# EAGLE design Custom Board 1_Final (EAGLE 6.5.0)
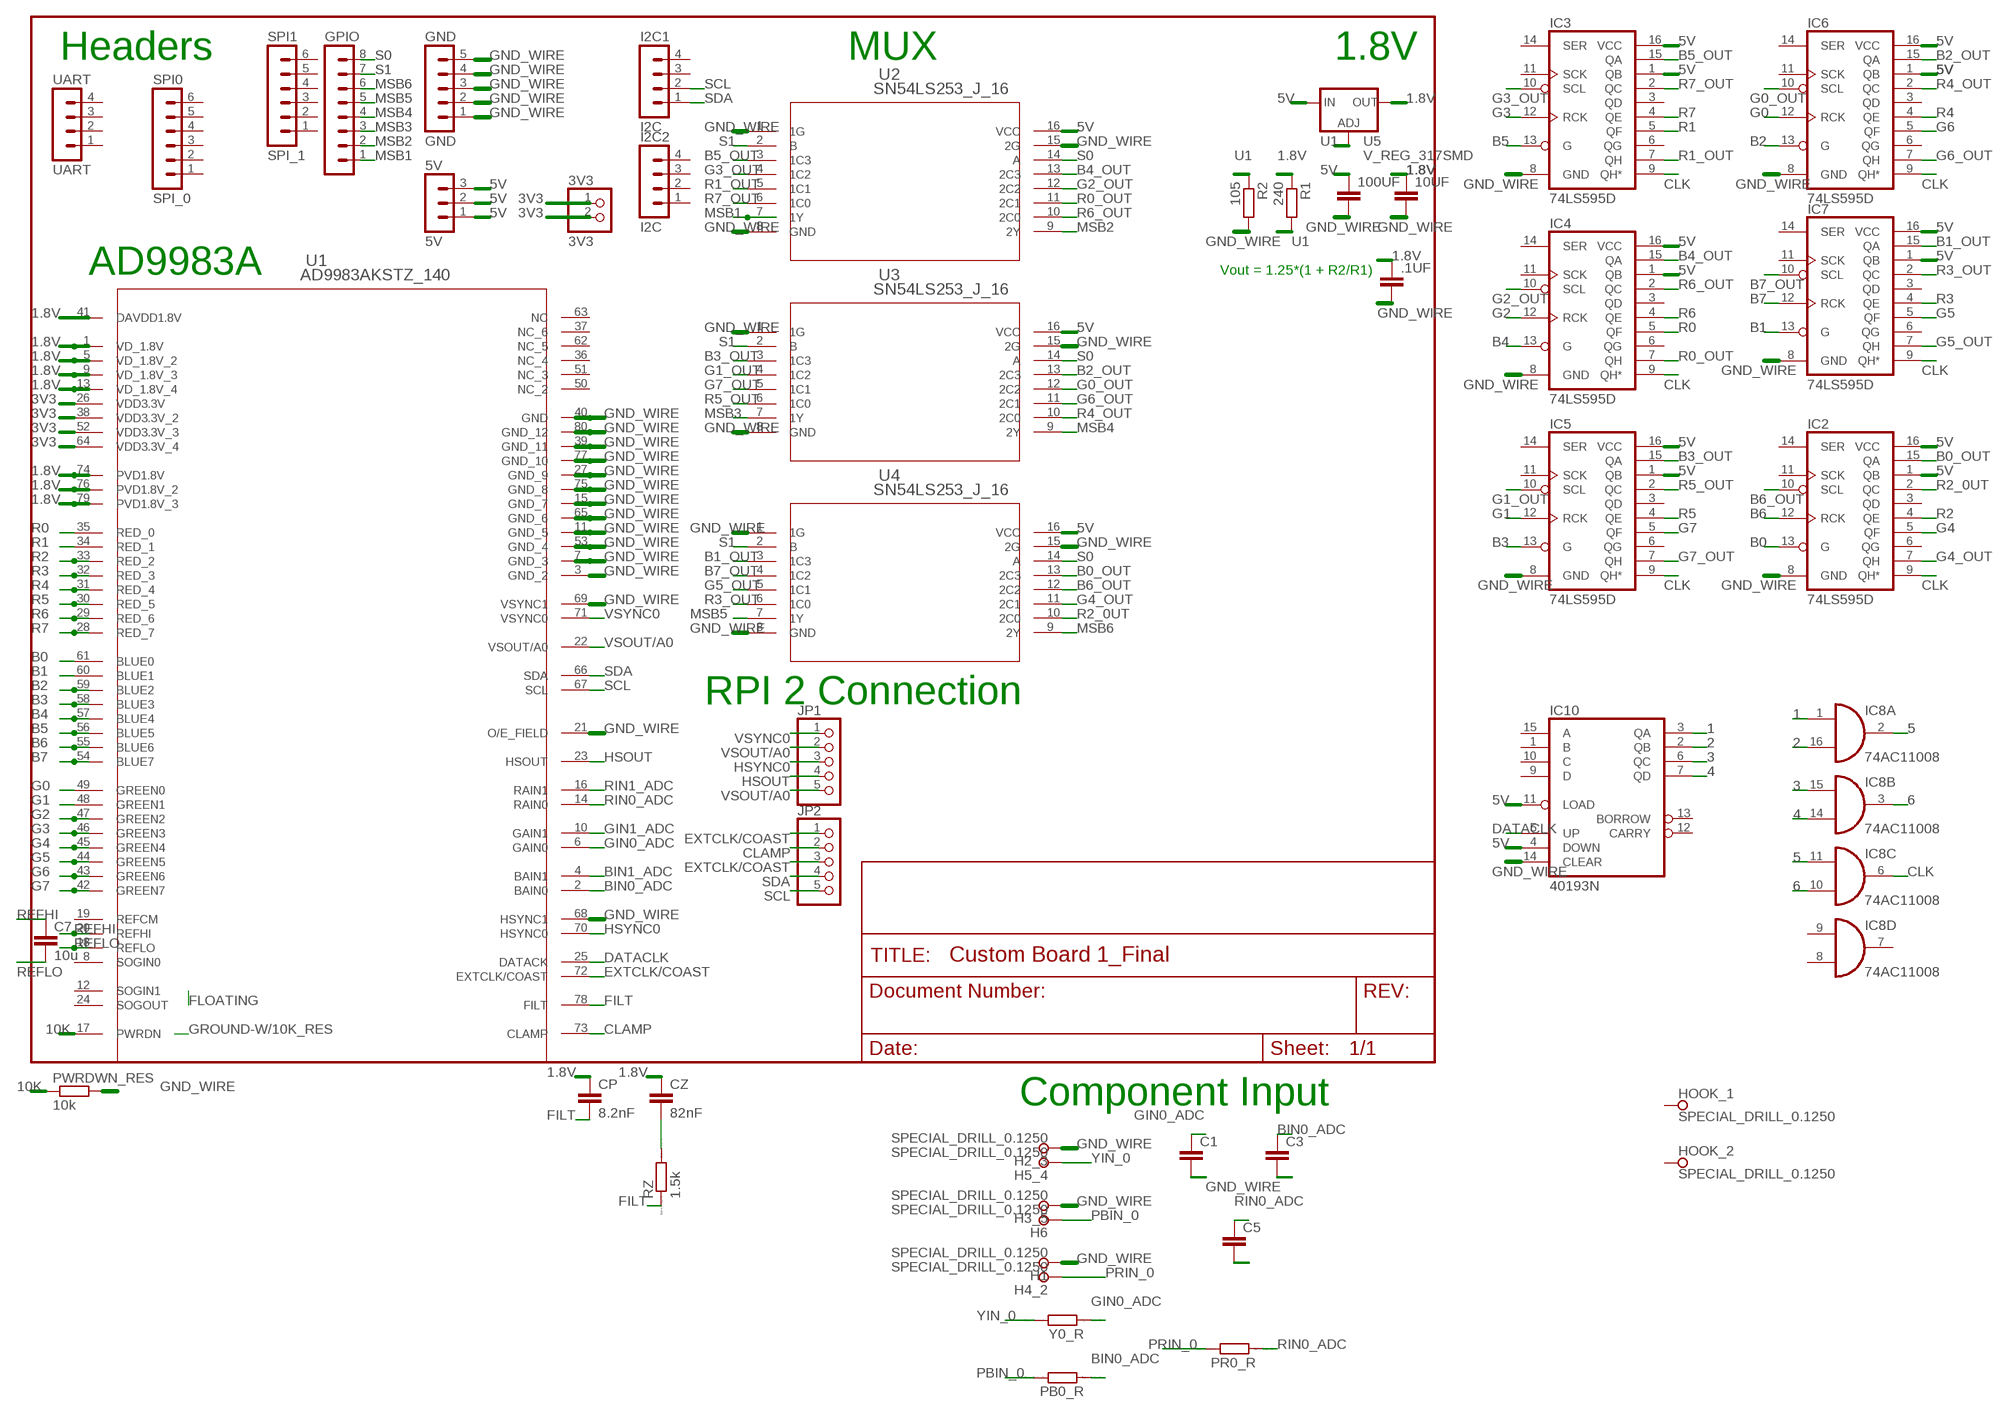
[diagram p0: schematic, sheet 1]

## Parts
3V3  3V3  PINHD-1X2  [1X02]
5V  5V  MA03-1  [MA03-1]
10UF  C2.5/5  [C2.5-5]
100UF  C2.5/5  [C2.5-5]
.1UF  C2.5/5  [C2.5-5]
C1  C2.5/5  [C2.5-5]
C3  C2.5/5  [C2.5-5]
C5  C2.5/5  [C2.5-5]
C7  10u  C2.5/5  [C2.5-5]
CP  8.2nF  C2.5/5  [C2.5-5]
CZ  82nF  C2.5/5  [C2.5-5]
GND  GND  MA05-1  [MA05-1]
GPIO  MA08-1  [MA08-1]
H1  SPECIAL_DRILL_0.1250  [PAD_0.1250]
H2_3  SPECIAL_DRILL_0.1250  [PAD_0.1250]
H3_5  SPECIAL_DRILL_0.1250  [PAD_0.1250]
H4_2  SPECIAL_DRILL_0.1250  [PAD_0.1250]
H5_4  SPECIAL_DRILL_0.1250  [PAD_0.1250]
H6  SPECIAL_DRILL_0.1250  [PAD_0.1250]
HOOK_1  SPECIAL_DRILL_0.1250  [PAD_0.1250]
HOOK_2  SPECIAL_DRILL_0.1250  [PAD_0.1250]
I2C1  I2C  MA04-1  [MA04-1]
I2C2  I2C  MA04-1  [MA04-1]
IC2  74LS595D  [SO16]
IC3  74LS595D  [SO16]
IC4  74LS595D  [SO16]
IC5  74LS595D  [SO16]
IC6  74LS595D  [SO16]
IC7  74LS595D  [SO16]
IC8  74AC11008  [DIL16]
IC10  40193N  [DIL16]
JP1  PINHD-1X5  [1X05]
JP2  PINHD-1X5  [1X05]
PB0_R  R0204/7  [0204/7]
PR0_R  R0204/7  [0204/7]
PWRDWN_RES  10k  R-EU_0204/7  [0204/7]
R1  240  R-EU_0204/7  [0204/7]
R2  105  R-EU_0204/7  [0204/7]
RZ  1.5k  R0204/7  [0204/7]
SPI0  SPI_0  MA06-1  [MA06-1]
SPI1  SPI_1  MA06-1  [MA06-1]
U1  AD9983AKSTZ_140  [ST_80_2]
U2  SN54LS253_J_16  [J16]
U3  SN54LS253_J_16  [J16]
U4  SN54LS253_J_16  [J16]
U5  V_REG_317SMD  [SOT223]
UART  UART  MA04-1  [MA04-1]
Y0_R  R0204/7  [0204/7]

## Nets
1: IC8.1(A:I0) IC10.3(QA)
1.8V [Power]: 10UF.1 .1UF.1 CP.1 CZ.1 R1.1 U1.1(VD_1.8V) U1.5(VD_1.8V_2) U1.9(VD_1.8V_3) U1.13(VD_1.8V_4) U1.41(DAVDD1.8V) U1.74(PVD1.8V) U1.76(PVD1.8V_2) U1.79(PVD1.8V_3) U5.2(OUT)
2: IC8.16(A:I1) IC10.2(QB)
3: IC8.15(B:I0) IC10.6(QC)
3V3 [Power]: 3V3.1 3V3.2 U1.26(VDD3.3V) U1.38(VDD3.3V_2) U1.52(VDD3.3V_3) U1.64(VDD3.3V_4)
4: IC8.14(B:I1) IC10.7(QD)
5: IC8.2(A:O) IC8.11(C:I0)
5V [Power]: 5V.1 5V.2 5V.3 100UF.1 IC2.1(QB) IC2.16(VCC) IC3.1(QB) IC3.16(VCC) IC4.1(QB) IC4.16(VCC) IC5.1(QB) IC5.16(VCC) IC6.1(QB) IC6.16(VCC) IC7.1(QB) IC7.16(VCC) IC10.4(DOWN) IC10.11(LOAD) U2.16(VCC) U3.16(VCC) U4.16(VCC) U5.3(IN)
6: IC8.3(B:O) IC8.10(C:I1)
10K: PWRDWN_RES.1 U1.17(PWRDN)
B0: IC2.13(G) U1.61(BLUE0)
B0_OUT: IC2.15(QA) U4.13(2C3)
B1: IC7.13(G) U1.60(BLUE1)
B1_OUT: IC7.15(QA) U4.3(1C3)
B2: IC6.13(G) U1.59(BLUE2)
B2_OUT: IC6.15(QA) U3.13(2C3)
B3: IC5.13(G) U1.58(BLUE3)
B3_OUT: IC5.15(QA) U3.3(1C3)
B4: IC4.13(G) U1.57(BLUE4)
B4_OUT: IC4.15(QA) U2.13(2C3)
B5: IC3.13(G) U1.56(BLUE5)
B5_OUT: IC3.15(QA) U2.3(1C3)
B6: IC2.12(RCK) U1.55(BLUE6)
B6_OUT: IC2.10(SCL) U4.12(2C2)
B7: IC7.12(RCK) U1.54(BLUE7)
B7_OUT: IC7.10(SCL) U4.4(1C2)
BIN0_ADC: C3.1 PB0_R.1 U1.2(BAIN0)
BIN1_ADC: U1.4(BAIN1)
CLAMP: JP2.2 U1.73(CLAMP)
CLK: IC2.9(QH*) IC3.9(QH*) IC4.9(QH*) IC5.9(QH*) IC6.9(QH*) IC7.9(QH*) IC8.6(C:O)
DATACLK: IC10.5(UP) U1.25(DATACK)
EXTCLK/COAST: JP2.1 JP2.3 U1.72(EXTCLK/COAST)
FILT: CP.2 RZ.1 U1.78(FILT)
G0: IC6.12(RCK) U1.49(GREEN0)
G0_OUT: IC6.10(SCL) U3.12(2C2)
G1: IC5.12(RCK) U1.48(GREEN1)
G1_OUT: IC5.10(SCL) U3.4(1C2)
G2: IC4.12(RCK) U1.47(GREEN2)
G2_OUT: IC4.10(SCL) U2.12(2C2)
G3: IC3.12(RCK) U1.46(GREEN3)
G3_OUT: IC3.10(SCL) U2.4(1C2)
G4: IC2.5(QF) U1.45(GREEN4)
G4_OUT: IC2.7(QH) U4.11(2C1)
G5: IC7.5(QF) U1.44(GREEN5)
G5_OUT: IC7.7(QH) U4.5(1C1)
G6: IC6.5(QF) U1.43(GREEN6)
G6_OUT: IC6.7(QH) U3.11(2C1)
G7: IC5.5(QF) U1.42(GREEN7)
G7_OUT: IC5.7(QH) U3.5(1C1)
GIN0_ADC: C1.1 U1.6(GAIN0) Y0_R.1
GIN1_ADC: U1.10(GAIN1)
GND_WIRE [Gnd]: 10UF.2 100UF.2 .1UF.2 C1.2 C3.2 C5.2 GND.1 GND.2 GND.3 GND.4 GND.5 H1.1 H2_3.1 H3_5.1 IC2.8(GND) IC3.8(GND) IC4.8(GND) IC5.8(GND) IC6.8(GND) IC7.8(GND) IC10.14(CLEAR) PWRDWN_RES.2 R2.2 U1.3(GND_2) U1.7(GND_3) U1.11(GND_5) U1.15(GND_7) U1.21(O/E_FIELD) U1.27(GND_9) U1.39(GND_11) U1.40(GND) U1.53(GND_4) U1.65(GND_6) U1.68(HSYNC1) U1.69(VSYNC1) U1.75(GND_8) U1.77(GND_10) U1.80(GND_12) U2.1(1G) U2.8(GND) U2.15(2G) U3.1(1G) U3.8(GND) U3.15(2G) U4.1(1G) U4.8(GND) U4.15(2G)
HSOUT: JP1.4 U1.23(HSOUT)
HSYNC0: JP1.3 U1.70(HSYNC0)
MSB1: GPIO.1 U2.7(1Y)
MSB2: GPIO.2 U2.9(2Y)
MSB3: GPIO.3 U3.7(1Y)
MSB4: GPIO.4 U3.9(2Y)
MSB5: GPIO.5 U4.7(1Y)
MSB6: GPIO.6 U4.9(2Y)
N$1: CZ.2 RZ.2
PBIN_0: H6.1 PB0_R.2
PRIN_0: H4_2.1 PR0_R.2
R0: IC4.5(QF) U1.35(RED_0)
R0_OUT: IC4.7(QH) U2.11(2C1)
R1: IC3.5(QF) U1.34(RED_1)
R1_OUT: IC3.7(QH) U2.5(1C1)
R2: IC2.4(QE) U1.33(RED_2)
R2_0UT: IC2.2(QC) U4.10(2C0)
R3: IC7.4(QE) U1.32(RED_3)
R3_OUT: IC7.2(QC) U4.6(1C0)
R4: IC6.4(QE) U1.31(RED_4)
R4_OUT: IC6.2(QC) U3.10(2C0)
R5: IC5.4(QE) U1.30(RED_5)
R5_OUT: IC5.2(QC) U3.6(1C0)
R6: IC4.4(QE) U1.29(RED_6)
R6_OUT: IC4.2(QC) U2.10(2C0)
R7: IC3.4(QE) U1.28(RED_7)
R7_OUT: IC3.2(QC) U2.6(1C0)
REFHI: C7.1 U1.20(REFHI)
REFLO: C7.2 U1.18(REFLO)
RIN0_ADC: C5.1 PR0_R.1 U1.14(RAIN0)
RIN1_ADC: U1.16(RAIN1)
S0: GPIO.8 U2.14(A) U3.14(A) U4.14(A)
S1: GPIO.7 U2.2(B) U3.2(B) U4.2(B)
SCL: I2C1.2 JP2.5 U1.67(SCL)
SDA: I2C1.1 JP2.4 U1.66(SDA)
U1: R1.2 R2.1 U5.1(ADJ)
VSOUT/A0: JP1.2 JP1.5 U1.22(VSOUT/A0)
VSYNC0: JP1.1 U1.71(VSYNC0)
YIN_0: H5_4.1 Y0_R.2
Unconnected: HOOK_1.1 HOOK_2.1 I2C1.3 I2C1.4 I2C2.1 I2C2.2 I2C2.3 I2C2.4 IC2.3(QD) IC2.6(QG) IC2.11(SCK) IC2.14(SER) IC3.3(QD) IC3.6(QG) IC3.11(SCK) IC3.14(SER) IC4.3(QD) IC4.6(QG) IC4.11(SCK) IC4.14(SER) IC5.3(QD) IC5.6(QG) IC5.11(SCK) IC5.14(SER) IC6.3(QD) IC6.6(QG) IC6.11(SCK) IC6.14(SER) IC7.3(QD) IC7.6(QG) IC7.11(SCK) IC7.14(SER) IC8.7(D:O) IC8.8(D:I1) IC8.9(D:I0) IC10.1(B) IC10.9(D) IC10.10(C) IC10.12(CARRY) IC10.13(BORROW) IC10.15(A) SPI0.1 SPI0.2 SPI0.3 SPI0.4 SPI0.5 SPI0.6 SPI1.1 SPI1.2 SPI1.3 SPI1.4 SPI1.5 SPI1.6 U1.8(SOGIN0) U1.12(SOGIN1) U1.19(REFCM) U1.24(SOGOUT) U1.36(NC_4) U1.37(NC_6) U1.50(NC_2) U1.51(NC_3) U1.62(NC_5) U1.63(NC) UART.1 UART.2 UART.3 UART.4

## Notes on the sheet
- Headers | MUX | 1.8V
- AD9983A | Vout = 1.25*(1 + R2/R1)
- RPI 2 Connection
- Component Input

## Power pins joined to a net without a drawn wire
GND: IC8.4(P:GND) IC8.5(P:GND)
VCC: IC8.12(P:VCC) IC8.13(P:VCC)
VDD: IC10.16(VDD)
VSS: IC10.8(VSS)

## Library data of the parts
3V3 = pinhead:PINHD-1X2: PIN HEADER
5V = con-lstb:MA03-1: PIN HEADER; OC_FARNELL: unknown; OC_NEWARK: unknown
10UF 100UF .1UF C1 C3 C5 C7 CP CZ = capacitor-wima:C: CAPACITOR naming: grid - package width
GND = con-lstb:MA05-1: PIN HEADER; OC_FARNELL: unknown; OC_NEWARK: unknown
GPIO = con-lstb:MA08-1: PIN HEADER; OC_FARNELL: unknown; OC_NEWARK: unknown
H1 H2_3 H3_5 H4_2 H5_4 H6 HOOK_1 HOOK_2 = special-drill:SPECIAL_DRILL_: Special drills
I2C1 I2C2 UART = con-lstb:MA04-1: PIN HEADER; OC_FARNELL: unknown; OC_NEWARK: unknown
IC2-IC7 = SparkFun-DigitalIC:74*595: 8-bit SHIFT REGISTER, output latch; PROD_ID: IC-07875
IC8 = 74ac-logic:74AC11008: Quadruple 2-input AND
IC10 = 40xx:40193: Binary up down COUNTER
JP1 JP2 = pinhead:PINHD-1X5: PIN HEADER
PB0_R PR0_R RZ Y0_R = eagle-ltspice:R: RESISTOR, European symbol; SPICEMODEL: NONE; SPICEPREFIX: R
PWRDWN_RES R1 R2 = rcl:R-EU_: RESISTOR, European symbol
SPI0 SPI1 = con-lstb:MA06-1: PIN HEADER; OC_FARNELL: unknown; OC_NEWARK: unknown
U1 = ad9983a:AD9983AKSTZ_140
U2-U4 = MUX:SN54LS253_J_16; DATASHEETURL: http://www.ti.com/lit/gpn/SN54LS253; DESCRIPTION: Dual 4-Line To 1-Line Data Selectors/Multiplexers With 3-State Outputs; FAMILY_NAME: DATA SELECTOR/MULTIPLEXER; GENERIC_PART_NUMBER: SN54LS253; INDUSTRY_STD_PKG_TYPE: CDIP; MANUFACTURER: Texas Instruments; PACKAGE_DESIGNATOR: J; PIN_COUNT: 16
U5 = SparkFun-PowerIC:V_REG_317: Voltage Regulator Standard LM317 adjustable voltage regulator. AOI (Adjust Output Input). Google 'LM317 Calculator' for easy to use app to get the two resistor values needed. 240/720 for 5V output. 240/390 for 3.3V output. Spark Fun Electronics SKU : COM-00527

## Net classes
1 Gnd: width 0.533 mm
2 Power: width 0.457 mm

## Board
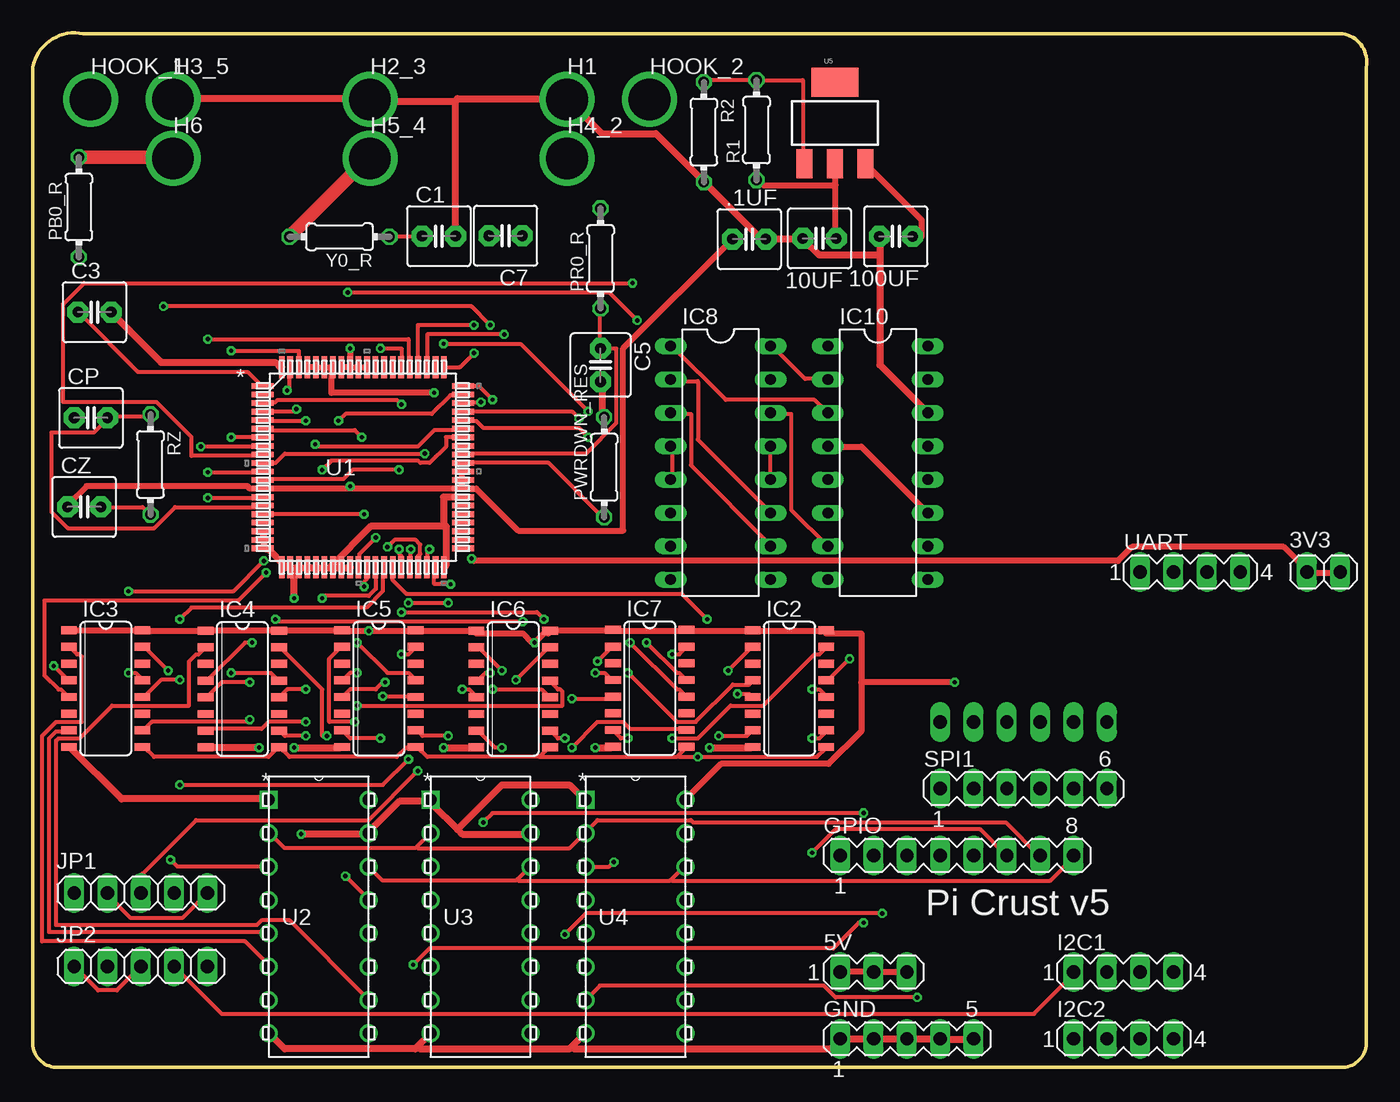
[diagram p1: board, top side]
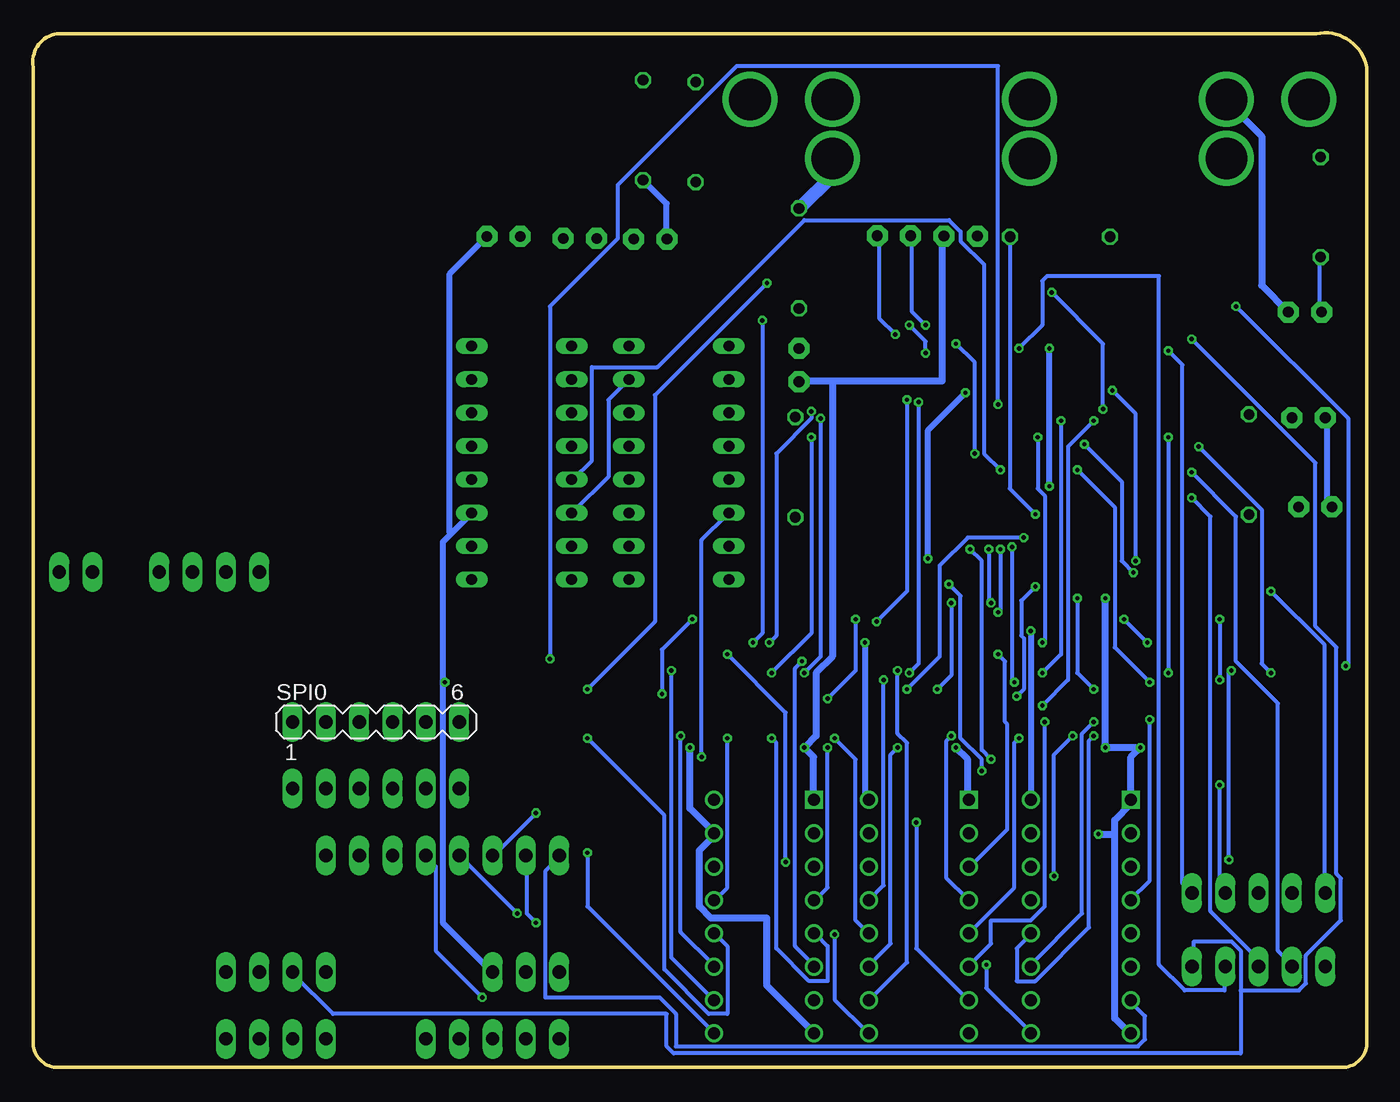
[diagram p2: board, bottom side, seen from below]

Size 101.63 x 78.79 mm. Coordinates in mm from the lower left corner, seen from the top.
Outline: 101.6,76.19 101.6,1.79 arc-90 99.69,0 1.91,0 arc-90 0,1.79 0,76.19 arc-90 3.82,78.73 99.82,78.73 arc-90 101.6,76.19
Copper layers (1*16): Top 0.0356mm / dielectric 1.5011mm / Bottom 0.0356mm
Design rules "default *": minimum track width 12mil, minimum drill 13mil, track to track 6mil, track to pad 6mil, pad to pad 6mil, via to via 6mil, smd to smd 6mil, copper to edge 15mil, drill to drill 6mil, minimum pad ring 7mil, minimum via ring 7mil, stop-mask expansion 4mil, vias tented up to drill 20mil, thermal gap 10mil

### Footprints (pad centres in the part's own frame; a part is rotated, then mirrored left to right if it is on the bottom)
1X02 = drill 1.016 long: 1 -1.27,0; 2 1.27,0
MA03-1 = drill 1.016 long: 1 -2.54,0; 2 0,0; 3 2.54,0
C2.5-5 = drill 0.813 pad 1.6 octagon: 1 -1.27,0; 2 1.27,0
MA05-1 = drill 1.016 long: 1 -5.08,0; 2 -2.54,0; 3 0,0; 4 2.54,0; 5 5.08,0
MA08-1 = drill 1.016 long: 1 -8.89,0; 2 -6.35,0; 3 -3.81,0; 4 -1.27,0; 5 1.27,0; 6 3.81,0; 7 6.35,0; 8 8.89,0
PAD_0.1250 = drill 3.175 pad 3.175: 1 0,0
MA04-1 = drill 1.016 long: 1 -3.81,0; 2 -1.27,0; 3 1.27,0; 4 3.81,0
SO16 = smd 0.6 x 1.2: 1 -4.445,-2.8; 2 -3.175,-2.8; 3 -1.905,-2.8; 4 -0.635,-2.8; 5 0.635,-2.8; 6 1.905,-2.8; 7 3.175,-2.8; 8 4.445,-2.8; 9 4.445,2.8; 10 3.175,2.8; 11 1.905,2.8; 12 0.635,2.8; 13 -0.635,2.8; 14 -1.905,2.8; 15 -3.175,2.8; 16 -4.445,2.8
DIL16 = drill 0.813 long: 1 -8.89,-3.81; 2 -6.35,-3.81; 3 -3.81,-3.81; 4 -1.27,-3.81; 5 1.27,-3.81; 6 3.81,-3.81; 7 6.35,-3.81; 8 8.89,-3.81; 9 8.89,3.81; 10 6.35,3.81; 11 3.81,3.81; 12 1.27,3.81; 13 -1.27,3.81; 14 -3.81,3.81; 15 -6.35,3.81; 16 -8.89,3.81
1X05 = drill 1.016 long: 1 -5.08,0; 2 -2.54,0; 3 0,0; 4 2.54,0; 5 5.08,0
0204/7 = drill 0.813 octagon: 1 -3.81,0; 2 3.81,0
MA06-1 = drill 1.016 long: 1 -6.35,0; 2 -3.81,0; 3 -1.27,0; 4 1.27,0; 5 3.81,0; 6 6.35,0
ST_80_2 = smd 0.432 x 1.676: 1 0.33,7.62; 5 -0.33,7.62; 8 2.286,7.62; 9 -0.965,7.62; 12 1.626,7.62; 13 -1.626,7.62; 15 -6.172,-7.62; 18 4.216,7.62; 19 5.537,7.62; 20 4.877,7.62; 22 -4.877,7.62; 23 4.877,-7.62; 24 0.965,7.62; 26 -2.286,7.62; 27 -5.537,-7.62; 28 6.172,7.62; 38 -2.921,7.62; 39 -4.877,-7.62; 40 -4.216,-7.62; 42 4.216,-7.62; 43 3.581,-7.62; 44 2.921,-7.62; 45 2.286,-7.62; 46 1.626,-7.62; 47 0.965,-7.62; 48 0.33,-7.62; 49 -0.33,-7.62; 52 -3.581,7.62; 53 -3.581,-7.62; 64 -4.216,7.62; 65 -2.921,-7.62; 66 2.921,7.62; 67 3.581,7.62; 68 6.172,-7.62; 69 -6.172,7.62; 70 5.537,-7.62; 71 -5.537,7.62; 75 -2.286,-7.62; 77 -1.626,-7.62; 80 -0.965,-7.62 | smd 1.676 x 0.432: 2 -7.62,6.172; 3 -7.62,-4.877; 4 -7.62,5.537; 6 -7.62,-3.581; 7 -7.62,-5.537; 10 -7.62,-4.216; 11 -7.62,-6.172; 14 7.62,0.965; 16 7.62,1.626; 17 7.62,0.33; 21 7.62,-2.286; 25 -7.62,-0.965; 29 7.62,6.172; 30 7.62,5.537; 31 7.62,4.877; 32 7.62,4.216; 33 7.62,3.581; 34 7.62,2.921; 35 7.62,2.286; 36 7.62,-6.172; 37 7.62,-5.537; 41 -7.62,-1.626; 50 7.62,-4.877; 51 7.62,-4.216; 54 -7.62,0.33; 55 -7.62,0.965; 56 -7.62,1.626; 57 -7.62,2.286; 58 -7.62,2.921; 59 -7.62,3.581; 60 -7.62,4.216; 61 -7.62,4.877; 62 7.62,-3.581; 63 7.62,-2.921; 72 -7.62,-2.286; 73 -7.62,-0.33; 74 7.62,-1.626; 76 7.62,-0.965; 78 -7.62,-2.921; 79 7.62,-0.33
J16 = drill 0.914 square: 1 -7.62,17.78 | drill 0.914: 2 -7.62,15.24; 3 -7.62,12.7; 4 -7.62,10.16; 5 -7.62,7.62; 6 -7.62,5.08; 7 -7.62,2.54; 8 -7.62,0; 9 0,0; 10 0,2.54; 11 0,5.08; 12 0,7.62; 13 0,10.16; 14 0,12.7; 15 0,15.24; 16 0,17.78
SOT223 = smd 1.219 x 2.235: 1 -2.311,-3.099; 2 0,-3.099; 3 2.311,-3.099 | smd 3.6 x 2.2: 4 0,3.099

### Placement (x,y rotation side)
3V3  98.35,37.73 0 top
5V  64.06,7.25 0 top
10UF  59.94,63.13 180 top
100UF  65.76,63.29 180 top
.1UF  54.58,63.08 0 top
C1  30.94,63.31 0 top
C3  4.7,57.52 0 top
C5  43.26,53.48 270 top
C7  36.02,63.34 180 top
CP  4.42,49.47 0 top
CZ  3.91,42.69 0 top
GND  66.6,2.17 0 top
GPIO  70.41,16.14 0 top
H1  40.7,73.73 0 top
H2_3  25.69,73.73 0 top
H3_5  10.68,73.73 0 top
H4_2  40.7,69.23 0 top
H5_4  25.69,69.23 0 top
H6  10.68,69.23 0 top
HOOK_1  4.39,73.73 0 top
HOOK_2  46.99,73.73 0 top
I2C1  83.11,7.25 0 top
I2C2  83.11,2.17 0 top
IC2  57.66,28.84 270 top
IC3  5.56,28.84 270 top
IC4  15.98,28.82 270 top
IC5  26.37,28.84 270 top
IC6  36.6,28.82 270 top
IC7  47.02,28.87 270 top
IC8  52.4,46.04 270 top
IC10  64.39,46.04 270 top
JP1  8.23,13.27 0 top
JP2  8.23,7.69 0 top
PB0_R  3.51,65.52 90 top
PR0_R  43.26,61.61 90 top
PWRDWN_RES  43.54,45.71 90 top
R1  55.14,71.39 90 top
R2  51.13,71.24 270 top
RZ  8.97,45.91 270 top
SPI0  75.49,26.3 0 bottom
SPI1  75.49,21.22 0 top
U1  25.15,45.71 0 top
U2  25.6,2.58 0 top
U3  37.92,2.58 0 top
U4  49.73,2.58 0 top
U5  61.11,71.92 0 top
UART  88.19,37.73 0 top
Y0_R  23.37,63.26 180 top

### Tracks (layer width: path | path; a pad name or v marks a point on that pad's centre or on a via)
1
  Top 0.305: IC8.1 48.72,54.93 52.81,50.84 59.56,50.84 60.45,49.95 IC10.3
1.8V  (via drill 0.33)
  Top 0.457: 61.16,67.2 61.16,63.29 10UF.1 | 61.16,67.2 61.16,68.8 U5.2 | 61.16,67.2 55.65,67.2 55.3,67.55 R1.1 | U1.9 U1.13 | U1.9 U1.5 U1.1 | U1.74 24.18,44.08 | 24.18,44.08 U1.41 16.54,44.08 16.36,44.26 4.09,44.26 2.67,42.84 CZ.1 | U1.74 32.72,44.26 32.72,44.62 U1.76 32.72,44.8 32.72,45.33 U1.79 | v24.18,54.75 U1.9 | v24.18,44.26 24.18,44.08 | .1UF.1 44.98,54.75 44.98,40.88 36.98,40.88 33.78,44.08 U1.74
  Bottom 0.457: R1.1 53.34,65.78 53.34,63.11 .1UF.1 | CZ.1 2.67,42.84 3.02,43.2 3.02,49.42 CP.1 | v24.18,44.26 v24.18,54.75
2
  Top 0.305: IC8.16 56.36,54.93 58.85,52.44 60.45,52.44 IC10.2
3
  Bottom 0.305: IC10.6 60.45,42.31 57.78,44.97 57.78,50.84 56.36,52.26 IC8.15
3V3  (via drill 0.33)
  Top 0.457: U1.64 U1.52 U1.38 U1.26 22.76,53.15 22.76,51.37 v30.58,51.37 | v33.43,38.75 33.6,38.57 82.68,38.57 83.74,39.64 95.3,39.64 97.08,37.86 3V3.1 97.26,37.68 99.57,37.68 3V3.2
  Bottom 0.457: v30.58,51.37 33.43,48.53 v33.43,38.75
4
  Top 0.305: IC10.7 57.78,42.48 57.78,49.77 56.36,49.77 IC8.14
5
  Top 0.305: IC8.11 56.19,42.31 50.67,47.82 50.67,52.26 48.72,52.26 IC8.2
5V  (via drill 0.33)
  Top 0.457: 63.12,29.33 63.12,33.06 60.45,33.06 IC2.16 60.45,33.24 54.94,33.24 IC2.1 54.76,33.24 49.96,33.24 IC7.16 49.61,33.24 44.27,33.24 IC7.1 44.09,33.24 39.47,33.24 IC6.16 39.29,33.06 38.94,33.06 v38.23,32.35 38.05,32.35 37.34,33.06 33.78,33.06 IC6.1 33.78,33.24 29.34,33.24 IC5.16 28.98,33.24 v25.6,33.24 23.65,33.24 IC5.1 23.47,33.24 18.85,33.24 IC4.16 18.67,33.24 13.34,33.24 IC4.1 13.16,33.24 8.53,33.24 IC3.16 8.18,33.24 2.85,33.24 IC3.1 | 63.12,29.33 63.12,25.59 60.63,23.1 52.45,23.1 49.78,20.44 U4.16 | 100UF.1 67.74,63.29 67.74,64.53 63.48,68.8 U5.3 | 5V.1 61.52,7.28 64.01,7.28 5V.2 64.19,7.28 66.5,7.28 5V.3 | IC10.11 68.1,42.31 63.12,47.29 60.63,47.29 IC10.4 | v70.23,29.33 63.12,29.33
  Bottom 0.457: v38.23,32.35 38.23,20.61 38.05,20.44 U3.16 | v25.6,33.24 U2.16 | 70.41,29.33 70.41,40 69.79,40.62 | 70.41,29.33 70.41,11.01 66.67,7.28 5V.3 | 69.79,40.62 68.28,42.13 IC10.11 | 100UF.1 69.88,60.44 69.88,40.71 69.79,40.62 | v70.23,29.33 70.41,29.33
6
  Top 0.305: IC8.10 56.19,39.82 50.14,45.86 50.14,49.77 48.72,49.77 IC8.3
10K
  Top 0.305: U1.17 39.29,46.04 43.38,41.95 PWRDWN_RES.1
B0  (via drill 0.33)
  Top 0.305: v62.23,31.1 60.63,29.5 IC2.13 | v28.09,50.48 27.74,50.84 18.67,50.84 18.49,50.66 17.6,50.66 U1.61
  Bottom 0.305: v62.23,31.1 62.23,57.95 57.07,63.11 57.07,67.2 48.01,76.27 28.09,76.27 v28.09,50.48
B0_OUT  (via drill 0.33)
  Top 0.305: v48.72,25.06 50.67,25.06 53.16,27.55 55.65,27.55 59.56,31.46 59.92,31.46 60.45,31.99 IC2.15
  Bottom 0.305: v48.72,25.06 48.72,13.68 49.61,12.79 U4.13
B1  (via drill 0.33)
  Top 0.305: v46.76,32.35 49.07,30.04 49.25,30.04 49.78,29.5 IC7.13 | v46.05,56.89 43.92,59.02 v24,59.02 | v20.09,50.13 19.91,49.95 17.6,49.95 U1.60
  Bottom 0.305: v46.76,32.35 46.05,33.06 v46.05,56.89 | v24,59.02 20.09,55.11 v20.09,50.13
B1_OUT  (via drill 0.33)
  Top 0.305: v48.72,31.46 49.25,31.46 49.78,31.99 IC7.15 | v44.27,15.64 43.92,15.28 U4.3
  Bottom 0.305: v48.72,31.46 44.27,27.02 v44.27,15.64
B2  (via drill 0.33)
  Top 0.305: v24.71,27.55 40.36,27.55 40.36,28.62 40.18,28.79 40.01,28.79 39.47,29.33 IC6.13 | v20.8,49.24 17.6,49.24 U1.59
  Bottom 0.305: v24.71,27.55 22.76,29.5 22.76,47.29 v20.8,49.24
B2_OUT  (via drill 0.33)
  Top 0.305: v36.8,29.5 39.29,31.99 IC6.15
  Bottom 0.305: v36.8,29.5 36.8,13.86 U3.13
B3  (via drill 0.33)
  Top 0.305: v24.71,32.35 27.03,30.04 28.63,30.04 29.16,29.5 IC5.13 | v25.07,48 24.54,48.53 17.6,48.53 U1.58
  Bottom 0.305: v24.71,32.35 24.54,32.53 24.54,43.55 25.07,44.08 v25.07,48
B3_OUT  (via drill 0.33)
  Top 0.305: v28.09,31.46 28.63,31.46 29.16,31.99 IC5.15
  Bottom 0.305: v28.09,31.46 27.56,30.93 27.56,26.3 27.38,26.13 27.38,18.13 30.23,15.28 U3.3
B4  (via drill 0.33)
  Top 0.305: v15.11,30.04 18.14,30.04 18.67,29.5 IC4.13 | U1.57 v15.11,48
  Bottom 0.305: v15.11,48 v15.11,30.04
B4_OUT  (via drill 0.33)
  Top 0.305: v22.4,25.24 22.05,25.24 22.05,28.79 18.85,31.99 IC4.15 | v23.82,14.57 25.6,12.79 U2.13
  Bottom 0.305: v22.4,25.24 23.82,23.81 v23.82,14.57
B5  (via drill 0.33)
  Top 0.305: v7.29,30.04 7.82,30.04 8.36,29.5 IC3.13 | v12.8,47.29 17.42,47.29 U1.56
  Bottom 0.305: v7.29,30.04 8,30.75 8,42.48 v12.8,47.29
B5_OUT  (via drill 0.33)
  Top 0.305: v10.31,30.22 8.53,31.99 IC3.15 | v10.49,15.81 11.02,15.28 U2.3
  Bottom 0.305: v10.31,30.22 10.49,30.04 v10.49,15.81
B6  (via drill 0.33)
  Top 0.305: v59.38,28.79 59.92,28.79 60.45,28.26 IC2.12 | v45.7,59.73 3.91,59.73 2.31,58.13 2.31,50.66 9.42,50.66 12.09,48 12.09,46.57 17.42,46.57 U1.55
  Bottom 0.305: v59.38,28.79 54.23,33.95 54.23,51.2 v45.7,59.73
B6_OUT  (via drill 0.33)
  Top 0.305: v59.38,25.06 59.92,25.06 60.45,25.59 IC2.10
  Bottom 0.305: v59.38,25.06 53.52,19.19 53.52,7.46 50.14,4.08 48.72,4.08 48.72,9.24 49.61,10.12 U4.12
B7  (via drill 0.33)
  Top 0.305: v45.52,32.35 49.07,28.79 49.25,28.79 49.78,28.26 IC7.12 | v42.32,49.95 37.16,55.11 v31.29,55.11 | v29.87,46.75 19.2,46.75 18.49,46.04 U1.54
  Bottom 0.305: v45.52,32.35 44.98,32.88 44.98,46.75 42.32,49.42 v42.32,49.95 | v31.29,55.11 29.87,53.69 v29.87,46.75
B7_OUT  (via drill 0.33)
  Top 0.305: v41.07,24.35 43.03,26.3 44.98,26.3 45.52,25.77 49.78,25.77 IC7.10
  Bottom 0.305: v41.07,24.35 41.07,13.68 41.96,12.79 U4.4
BIN0_ADC
  Top 0.305: U1.2 17.42,51.91 16.36,52.97 8,52.97 3.56,57.42 C3.1
  Bottom 0.305: PB0_R.1 3.56,61.69 3.56,57.6 C3.1
CLAMP  (via drill 0.33)
  Top 0.305: v13.34,45.33 17.42,45.33 U1.73
  Bottom 0.305: v13.34,45.33 9.96,41.95 9.96,30.93 6.76,27.73 6.76,8.88 5.69,7.81 JP2.2
CLK  (via drill 0.33)
  Top 0.305: IC3.9 8.53,24.35 9.25,23.64 17.96,23.64 18.67,24.35 IC4.9 18.85,24.35 19.56,23.64 27.74,23.64 28.45,24.35 29.16,24.35 IC5.9 29.34,24.35 30.05,23.64 38.58,23.64 38.67,23.73 | 38.67,23.73 39.29,24.35 IC6.9 | 49.16,23.73 49.07,23.64 38.76,23.64 38.67,23.73 | 49.16,23.73 49.78,24.35 IC7.9 | IC2.9 60.45,24.35 59.74,23.64 v50.67,23.64 49.25,23.64 49.16,23.73
  Bottom 0.305: v50.67,23.64 50.67,40.17 48.72,42.13 IC8.6
DATACLK  (via drill 0.33)
  Top 0.305: v27.91,45.51 24.36,45.51 23.65,44.8 17.6,44.8 U1.25
  Bottom 0.305: v27.91,45.51 29.16,46.75 29.16,61.15 30.94,62.93 30.94,63.64 31.83,64.53 42.85,64.53 54.05,53.33 59.03,53.33 59.03,46.22 60.45,44.8 IC10.5
EXTCLK/COAST  (via drill 0.33)
  Top 0.305: v13.34,43.37 17.42,43.37 U1.72 | JP2.1 4.98,5.86 6.4,5.86 JP2.3
  Bottom 0.305: v13.34,43.37 11.91,41.95 11.91,11.9 8.36,8.35 8.36,7.81 JP2.3
FILT
  Top 0.305: U1.78 17.42,42.66 10.85,42.66 9.25,41.06 2.67,41.06 1.42,42.31 1.42,48.35 4.62,48.35 5.69,49.42 CP.2 5.69,49.6 8.89,49.6 RZ.1
G0  (via drill 0.33)
  Top 0.305: v35.03,28.79 38.76,28.79 39.29,28.26 IC6.12 | v26.14,40.35 24.89,39.11 24.89,38.22 U1.49
  Bottom 0.305: v35.03,28.79 32.54,31.28 32.54,38.22 30.4,40.35 v26.14,40.35
G0_OUT  (via drill 0.33)
  Top 0.305: v40.54,25.06 40.01,25.06 39.47,25.59 IC6.10
  Bottom 0.305: v40.54,25.06 38.94,23.46 38.94,11.19 38.05,10.3 U3.12
G1  (via drill 0.33)
  Top 0.305: v26.67,28.26 29.16,28.26 IC5.12 | v25.25,36.62 25.25,36.97 25.43,37.15 25.43,38.04 U1.48
  Bottom 0.305: v26.67,28.26 26.14,28.79 26.14,32.71 26.31,32.88 26.31,35.55 v25.25,36.62
G1_OUT  (via drill 0.33)
  Top 0.305: v31.65,25.24 29.69,25.24 29.34,25.59 IC5.10
  Bottom 0.305: v31.65,25.24 32,24.88 32,14.39 30.4,12.79 U3.4
G2  (via drill 0.33)
  Top 0.305: v20.8,28.79 19.38,28.79 18.85,28.26 IC4.12 | v22.05,35.73 22.23,35.91 25.6,35.91 26.14,36.44 26.14,38.04 U1.47
  Bottom 0.305: v20.8,28.79 22.05,30.04 v22.05,35.73
G2_OUT  (via drill 0.33)
  Top 0.305: v20.8,25.24 19.2,25.24 18.85,25.59 IC4.10
  Bottom 0.305: v20.8,25.24 21.16,24.88 21.16,10.66 25.25,6.57 26.67,6.57 26.67,9.06 25.6,10.12 U2.12
G3  (via drill 0.33)
  Top 0.305: v11.2,29.5 9.78,29.5 8.53,28.26 IC3.12 | v11.2,34.13 12.09,35.02 25.43,35.02 26.67,36.26 26.67,38.04 U1.46
  Bottom 0.305: v11.2,34.13 v11.2,29.5
G3_OUT  (via drill 0.33)
  Top 0.305: v16.54,26.48 16.36,26.3 9.07,26.3 8.53,25.77 IC3.10
  Bottom 0.305: v16.54,26.48 16.54,14.21 17.96,12.79 U2.4
G4  (via drill 0.33)
  Top 0.305: v53.7,28.44 54.59,28.44 54.76,28.26 IC2.5 | v51.38,34.13 49.43,36.08 28.45,36.08 27.38,37.15 27.38,38.04 U1.45
  Bottom 0.305: v53.7,28.44 53.7,31.82 v51.38,34.13
G4_OUT  (via drill 0.33)
  Top 0.305: v52.27,25.24 54.41,25.24 54.76,25.59 IC2.7
  Bottom 0.305: v52.27,25.24 52.27,10.3 49.78,7.81 U4.11
G5  (via drill 0.33)
  Top 0.305: v41.07,28.08 44.09,28.08 IC7.5 | v38.94,34.13 38.41,34.66 v28.09,34.66 | v27.91,39.46 27.91,39.11 28.09,38.93 28.09,38.22 U1.44
  Bottom 0.305: v41.07,28.08 38.94,30.22 v38.94,34.13 | v28.09,34.66 27.91,34.84 v27.91,39.46
G5_OUT  (via drill 0.33)
  Top 0.305: v45.34,25.06 44.81,25.06 44.27,25.59 IC7.7
  Bottom 0.305: v45.34,25.06 44.98,24.7 44.98,9.06 42.49,6.57 41.07,6.57 41.07,9.24 41.96,10.12 U4.5
G6  (via drill 0.33)
  Top 0.305: v32.72,28.79 33.25,28.79 33.78,28.26 IC6.5 | v28.63,35.37 v31.65,35.37 | v28.8,39.46 28.8,38.22 U1.43
  Bottom 0.305: v32.72,28.79 31.65,29.86 v31.65,35.37 | v28.63,35.37 28.8,35.55 v28.8,39.46
G6_OUT  (via drill 0.33)
  Top 0.305: v35.74,24.35 35.2,24.35 33.96,25.59 IC6.7
  Bottom 0.305: v35.74,24.35 36.27,23.81 36.27,9.41 37.87,7.81 U3.11
G7  (via drill 0.33)
  Top 0.305: v26.85,29.33 26.67,29.33 26.14,28.79 24.18,28.79 23.65,28.26 IC5.5 | v27.03,39.64 27.56,40.17 29.16,40.17 29.52,39.82 29.52,39.11 29.34,38.93 29.34,38.22 U1.42
  Bottom 0.305: v26.85,29.33 27.03,29.5 v27.03,39.64
G7_OUT  (via drill 0.33)
  Top 0.305: v26.49,25.06 24.18,25.06 23.65,25.59 IC5.7
  Bottom 0.305: v26.49,25.06 26.85,24.7 26.85,13.68 30.23,10.3 U3.5
GIN0_ADC  (via drill 0.33)
  Top 0.305: v25.25,42.13 U1.6 | C1.1 29.52,63.29 27.2,63.29 Y0_R.1
  Bottom 0.305: v25.25,42.13 27.2,44.08 27.2,63.11 Y0_R.1
GND
  Top 0.305: IC8.5 48.72,44.8 48.72,47.29 IC8.4
GND_WIRE  (via drill 0.33)
  Top 0.533: U1.3 17.6,40.71 17.6,40.35 U1.7 17.6,40.17 17.6,39.64 U1.11 17.78,39.46 17.96,39.46 19.2,38.22 19.2,38.04 | 19.2,38.04 19.56,38.04 U1.27 19.74,38.04 19.91,38.04 | 19.2,38.04 19.02,38.04 U1.15 | 19.91,38.04 20.27,38.04 U1.39 20.45,38.04 20.8,38.04 U1.40 21.16,38.04 21.51,38.04 U1.53 21.69,38.04 22.23,38.04 U1.65 22.4,38.04 22.76,38.04 U1.75 | U1.75 23.11,38.04 23.47,38.04 U1.77 23.65,38.04 24.18,38.04 U1.80 | 31.29,41.24 25.78,41.24 22.76,38.22 U1.75 | 31.29,41.24 31.47,41.24 31.47,38.22 U1.68 | v17.25,24.35 13.34,24.35 IC4.8 | IC3.8 2.85,24.35 6.76,20.44 17.96,20.44 U2.1 | v19.91,24.35 23.47,24.35 IC5.8 | v19.91,35.73 19.91,38.04 | GND.5 71.65,2.12 69.34,2.12 GND.4 68.99,2.12 66.67,2.12 GND.3 66.5,2.12 64.19,2.12 GND.2 64.01,2.12 61.52,2.12 GND.1 61.34,1.95 60.81,1.41 41.25,1.41 41.07,1.59 | v51.56,24.35 54.76,24.35 IC2.8 | 29.34,1.59 30.23,2.48 U3.8 | 29.34,1.59 29.16,1.41 19.2,1.41 18.14,2.48 U2.8 | 41.07,1.59 40.89,1.41 29.52,1.41 29.34,1.59 | 41.07,1.59 41.96,2.48 U4.8 | U1.69 18.85,53.33 18.49,53.69 9.78,53.69 6.04,57.42 C3.2 | IC10.14 64.54,53.51 64.54,61.86 | 64.54,61.86 64.54,63.29 100UF.2 | 64.54,61.86 59.92,61.86 58.85,62.93 10UF.2 58.67,63.11 56.01,63.11 .1UF.2 55.83,63.11 55.47,63.11 51.21,67.38 R2.2 51.03,67.55 47.47,71.11 43.38,71.11 40.89,73.6 H1.1 40.54,73.78 32.36,73.78 32.18,73.6 | v42.85,24.35 44.09,24.35 IC7.8 | v31.29,24.35 33.78,24.35 IC6.8 | 32.36,18.13 30.4,20.08 U3.1 30.23,20.26 27.91,20.26 25.6,17.95 U2.15 25.43,17.77 v20.45,17.77 | 32.36,18.13 32.72,17.77 37.87,17.77 U3.15 | 32.36,18.13 35.74,21.5 40.89,21.5 41.96,20.44 U4.1
  Top 0.533: PWRDWN_RES.2 43.38,49.6 43.38,52.09 C5.2 | 32.18,73.6 32.18,63.47 C1.2 | 32.18,73.6 25.78,73.6 H2_3.1 25.6,73.78 10.85,73.78 H3_5.1 | U1.21 31.29,43.42 31.29,41.24
  Bottom 0.533: 17.42,24.17 17.96,23.64 17.96,20.44 U2.1 17.96,20.08 19.2,18.84 19.2,17.77 | 17.42,24.17 v17.25,24.35 | 17.42,24.17 17.6,24.35 v19.91,24.35 v19.91,35.73 | v51.56,24.35 51.56,19.73 49.78,17.95 U4.15 49.78,17.59 50.85,16.52 50.85,12.26 49.96,11.37 45.7,11.37 45.7,6.21 42.14,2.66 U4.8 | 19.2,17.77 19.2,3.72 18.14,2.66 U2.8 | C3.2 8,59.55 8,70.93 10.67,73.6 H3_5.1 | U4.1 42.14,20.44 42.14,23.64 v42.85,24.35 41.96,25.24 41.96,30.04 40.72,31.28 40.72,52.26 | v31.29,24.35 30.4,23.46 30.4,20.44 U3.1 | 40.72,52.26 32.36,52.26 32.36,63.29 C1.2 | 40.72,52.26 43.2,52.26 C5.2 | v20.45,17.77 19.2,17.77
HSOUT  (via drill 0.33)
  Top 0.305: v30.23,39.46 30.05,39.46 30.05,38.22 U1.23 | v28.63,23.46 26.67,21.5 v11.2,21.5
  Bottom 0.305: v30.23,39.46 29.34,38.57 29.34,24.17 v28.63,23.46 | v11.2,21.5 11.2,13.68 10.85,13.33 JP1.4
HSYNC0  (via drill 0.33)
  Top 0.305: v31.83,36.8 30.58,36.8 30.58,38.04 U1.70 | v29.34,22.57 25.6,18.84 12.45,18.84 8.36,14.75 8.36,13.33 JP1.3
  Bottom 0.305: v31.83,36.8 30.94,35.91 30.94,25.06 29.34,23.46 v29.34,22.57
MSB1
  Bottom 0.305: U2.7 17.96,4.97 16.89,3.9 16.89,2.12 17.42,1.59 52.63,1.59 52.63,4.08 53.87,5.32 62.59,5.32 62.59,14.93 61.52,15.99 GPIO.1
MSB2  (via drill 0.33)
  Top 0.305: v28.98,7.81 30.23,9.06 60.98,9.06 62.94,11.01 v63.3,11.01
  Bottom 0.305: v28.98,7.81 28.98,6.04 25.6,2.66 U2.9 | v63.3,11.01 64.01,11.72 64.01,15.99 GPIO.2
MSB3  (via drill 0.33)
  Top 0.305: v34.31,18.66 35.03,19.37 v63.3,19.37
  Bottom 0.305: v34.31,18.66 34.31,9.06 30.4,5.15 U3.7 | v63.3,19.37 66.5,16.17 GPIO.3
MSB4  (via drill 0.33)
  Top 0.305: v40.54,10.12 42.14,11.72 v64.72,11.72
  Bottom 0.305: v40.54,10.12 40.54,5.15 38.05,2.66 U3.9 | GPIO.4 v64.72,11.72
MSB5  (via drill 0.33)
  Top 0.305: U4.7 43.2,6.21 60.27,6.21 61.16,5.32 v67.39,5.32
  Bottom 0.305: v67.39,5.32 70.94,8.88 70.94,15.28 71.65,15.99 GPIO.5
MSB6  (via drill 0.33)
  Top 0.305: v59.38,16.35 61.16,18.13 72.19,18.13 74.14,16.17 GPIO.6
  Bottom 0.305: v59.38,16.35 59.38,12.26 49.78,2.66 U4.9
N$1
  Top 0.305: RZ.2 8.89,42.13 8.36,42.66 5.33,42.66 CZ.2
PBIN_0
  Top 0.305: 10.67,69.33 H6.1
  Top 1.016: 10.67,69.33 PB0_R.2
PRIN_0
  Bottom 0.305: 43.2,65.42 PR0_R.2 | 40.72,69.15 H4_2.1
  Bottom 1.016: 43.2,65.42 40.72,67.91 40.72,69.15
R0  (via drill 0.33)
  Top 0.305: v16.54,29.33 14.4,29.33 13.34,28.26 IC4.5 | v22.05,45.51 22.76,46.22 29.34,46.22 29.52,46.04 30.23,46.04 31.47,47.29 31.47,48 U1.35
  Bottom 0.305: v16.54,29.33 19.2,31.99 19.2,42.66 v22.05,45.51
R0_OUT  (via drill 0.33)
  Top 0.305: v20.8,26.3 17.96,26.3 17.42,25.77 13.34,25.77 IC4.7
  Bottom 0.305: v20.8,26.3 21.69,25.41 21.69,11.72 25.6,7.81 U2.11
R1  (via drill 0.33)
  Top 0.305: v17.78,37.68 15.65,35.55 0.89,35.55 0.89,29.86 1.96,28.79 2.13,28.79 2.67,28.26 IC3.5 | v21.51,47.46 21.69,47.29 29.34,47.29 30.58,48.53 32.72,48.53 U1.34
  Bottom 0.305: v17.78,37.68 18.67,38.57 18.67,44.62 v21.51,47.46
R1_OUT
  Top 0.305: IC3.7 2.67,25.59 1.78,25.59 1.25,25.06 1.25,10.3 17.96,10.3 U2.5
R2  (via drill 0.33)
  Top 0.305: v45.34,30.04 49.07,26.3 50.49,26.3 53.34,29.15 54.59,29.15 54.76,29.33 IC2.4 | v42.32,48 41.6,48.71 34.31,48.71 33.78,49.24 32.89,49.24 U1.33
  Bottom 0.305: v45.34,30.04 42.32,33.06 v42.32,48
R2_0UT  (via drill 0.33)
  Top 0.305: v52.98,30.22 54.76,31.99 IC2.2
  Bottom 0.305: v52.98,30.22 52.98,8.35 49.78,5.15 U4.10
R3  (via drill 0.33)
  Top 0.305: v42.85,30.04 43.56,30.04 44.09,29.5 IC7.4 | v41.6,49.42 41.07,49.95 32.89,49.95 U1.32
  Bottom 0.305: v42.85,30.04 41.6,31.28 v41.6,49.42
R3_OUT  (via drill 0.33)
  Top 0.305: v43.03,30.93 44.09,31.99 IC7.2
  Bottom 0.305: v43.03,30.93 43.56,30.39 43.56,9.24 42.14,7.81 U4.6
R4  (via drill 0.33)
  Top 0.305: v34.85,30.04 34.49,30.04 33.96,29.5 IC6.4 | v34.14,50.66 32.89,50.66 U1.31
  Bottom 0.305: v34.85,30.04 34.14,30.75 v34.14,50.66
R4_OUT  (via drill 0.33)
  Top 0.305: v35.74,30.22 33.96,31.99 IC6.2
  Bottom 0.305: v35.74,30.22 35.74,25.41 35.03,24.7 35.03,7.99 37.87,5.15 U3.10
R5  (via drill 0.33)
  Top 0.305: v24.71,30.04 24.18,30.04 23.65,29.5 IC5.4 | v23.29,49.24 23.82,49.77 30.4,49.77 31.83,51.2 32.72,51.2 U1.30
  Bottom 0.305: v24.71,30.04 23.29,31.46 v23.29,49.24
R5_OUT  (via drill 0.33)
  Top 0.305: v24.54,26.3 22.58,26.3 22.58,31.1 23.47,31.99 IC5.2
  Bottom 0.305: v24.54,26.3 24.54,12.26 25.6,11.19 28.63,11.19 28.63,9.41 30.23,7.81 U3.6
R6  (via drill 0.33)
  Top 0.305: v16.71,32.35 16.18,32.35 13.34,29.5 IC4.4 | v18.49,34.13 18.67,33.95 v37.34,33.95 | v35.03,50.84 33.96,51.91 32.89,51.91 U1.29
  Bottom 0.305: v18.49,34.13 v16.71,32.35 | v37.34,33.95 35.03,36.26 v35.03,50.84
R6_OUT
  Top 0.305: IC4.2 13.16,31.99 12.62,31.46 12.45,31.46 11.91,30.93 11.91,27.55 6.04,27.55 3.56,25.06 1.96,25.06 1.78,24.88 1.78,10.84 17.07,10.84 17.42,11.19 19.56,11.19 25.6,5.15 U2.10
R7  (via drill 0.33)
  Top 0.305: v1.6,30.57 2.67,29.5 IC3.4 | v9.96,57.95 33.43,57.95 v34.85,56.53 | v33.6,54.4 32.54,53.33 U1.28
  Bottom 0.305: v1.6,30.57 1.42,30.75 1.42,49.42 v9.96,57.95 | v34.85,56.53 33.6,55.29 v33.6,54.4
R7_OUT
  Top 0.305: IC3.2 2.85,31.99 3.38,31.46 3.56,31.46 3.73,31.28 3.73,26.3 1.78,26.3 0.71,25.24 0.71,9.59 16.18,9.59 17.96,7.81 U2.6
REFHI  (via drill 0.33)
  Top 0.305: v35.92,55.82 30.05,55.82 30.05,53.33 U1.20
  Bottom 0.305: v35.92,55.82 37.16,57.06 37.16,63.29 C7.1
REFLO  (via drill 0.33)
  Top 0.305: v33.6,56.53 29.34,56.53 29.34,53.33 U1.18
  Bottom 0.305: v33.6,56.53 34.67,57.6 34.67,63.29 C7.2
RIN0_ADC
  Top 0.305: U1.14 32.89,46.75 42.14,46.75 44.45,49.06 44.45,54.75 C5.1 43.2,54.75 43.2,57.77 PR0_R.1
S0
  Top 0.305: U2.14 26.67,14.21 36.8,14.21 36.89,14.3 | 36.89,14.3 37.87,15.28 U3.14 | 48.63,14.3 48.54,14.21 36.98,14.21 36.89,14.3 | 48.63,14.3 49.61,15.28 U4.14 | GPIO.8 79.3,15.99 77.52,14.21 48.72,14.21 48.63,14.3
S1
  Top 0.305: 29.25,16.79 30.23,17.77 U3.2 | 29.25,16.79 29.16,16.7 19.2,16.7 18.14,17.77 U2.2 | 29.25,16.79 29.34,16.7 40.89,16.7 41.96,17.77 U4.2 42.14,17.95 43.03,18.84 50.14,18.84 50.32,18.66 74.14,18.66 76.63,16.17 GPIO.7
SCL  (via drill 0.33)
  Top 0.305: v13.34,55.46 28.63,55.46 28.63,53.33 U1.67
  Bottom 0.305: v13.34,55.46 3.91,46.04 3.91,33.59 2.31,31.99 2.31,14.75 1.96,14.39 1.96,11.19 4.62,8.52 4.62,6.39 5.16,5.86 9.6,5.86 | 9.6,5.86 9.6,8.88 10.31,9.59 13.16,9.59 13.16,7.81 JP2.5 | 9.6,5.86 9.6,1.06 52.81,1.06 53.34,1.59 53.34,4.08 78.77,4.08 81.79,7.1 I2C1.2
SDA  (via drill 0.33)
  Top 0.305: v26.49,54.75 28.09,54.75 28.09,53.33 U1.66 | I2C1.1 79.3,7.1 76.28,4.08 14.4,4.08 10.85,7.63 JP2.4
  Bottom 0.305: v26.49,54.75 24.71,56.53 24.71,59.91 24.36,60.26 15.82,60.26 15.82,7.81 13.87,5.86 10.85,5.86 10.85,7.63 JP2.4
U1
  Top 0.305: U5.1 58.67,68.98 58.67,75.2 R1.2 51.21,75.2 R2.1
VCC
  Top 0.305: IC8.12 56.19,44.8 56.19,47.29 IC8.13
VSOUT/A0  (via drill 0.33)
  Top 0.305: U1.22 20.27,54.58 v15.11,54.58 | JP1.2 5.69,13.15 7.47,11.37 11.38,11.37 13.16,13.15 JP1.5
  Bottom 0.305: v15.11,54.58 14.05,53.51 14.05,14.04 13.34,13.33 JP1.5
VSYNC0  (via drill 0.33)
  Top 0.305: v19.38,51.55 19.56,51.55 19.56,53.33 U1.71 | v17.6,38.57 15.29,36.26 v7.29,36.26
  Bottom 0.305: v19.38,51.55 17.6,49.77 v17.6,38.57 | v7.29,36.26 3.2,32.17 3.2,13.33 JP1.1
YIN_0
  Top 0.305: 25.43,69.15 25.6,69.15 H5_4.1 | 19.56,63.29 Y0_R.2
  Top 1.016: 25.43,69.15 19.56,63.29

### Text on the board
tNames: Pi Crust v5